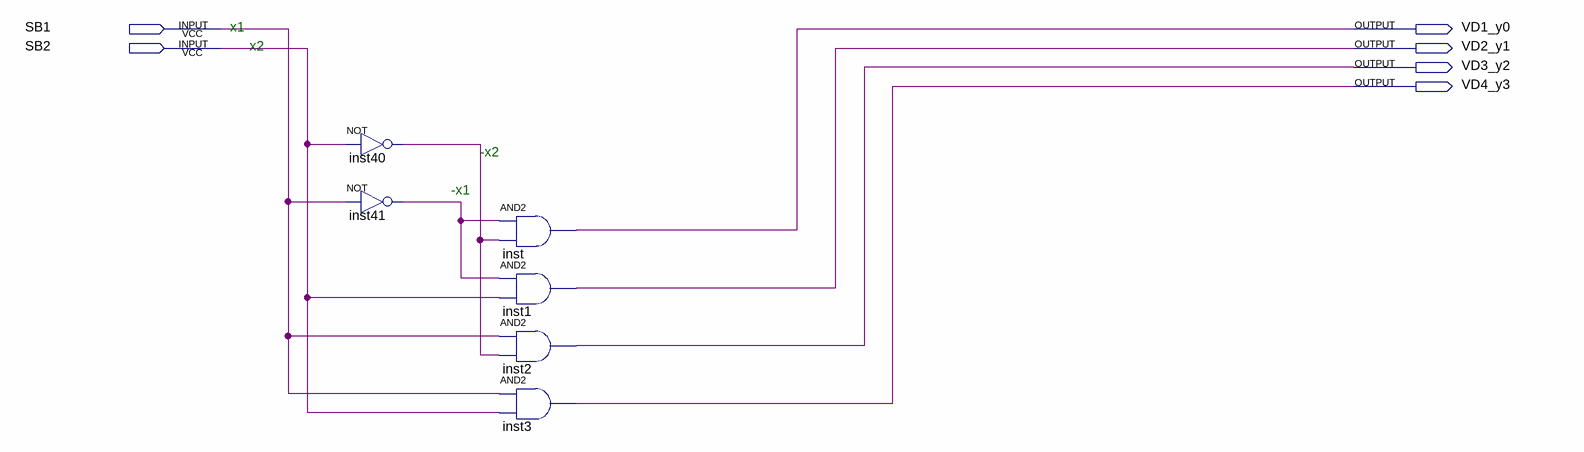
[diagram p0: schematic sheet]
// Quartus schematic project3.bdf as structural Verilog: 6 symbols, 6 pins
module project3 (
  input  SB1,
  input  SB2,
  output VD1_y0,
  output VD2_y1,
  output VD3_y2,
  output VD4_y3
);

  wire inst40_out, inst41_out;

  not inst40 (inst40_out, SB2);
  not inst41 (inst41_out, SB1);
  and inst (VD1_y0, inst41_out, inst40_out);
  and inst1 (VD2_y1, inst41_out, SB2);
  and inst2 (VD3_y2, SB1, inst40_out);
  and inst3 (VD4_y3, SB1, SB2);

  // Notes on the sheet:
  //   x1
  //   x2
  //   -x2
  //   -x1
endmodule
